# EAGLE design ECG-EEG (EAGLE 7.2.0)
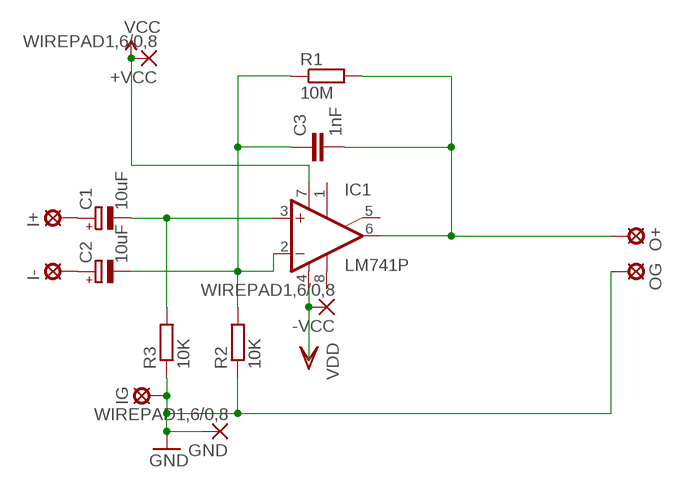
[diagram p0: schematic, sheet 1]

## Parts
+VCC  WIREPAD1,6/0,8  [1,6/0,8]
-VCC  WIREPAD1,6/0,8  [1,6/0,8]
C1  10uF  CPOL-EUE1.8-4  [E1,8-4]
C2  10uF  CPOL-EUE1.8-4  [E1,8-4]
C3  1nF  C-EU025-025X050  [C025-025X050]
GND  WIREPAD1,6/0,8  [1,6/0,8]
I+  LSP10  [LSP10]
I-  LSP10  [LSP10]
IC1  LM741P  [DIL08]
IG  LSP10  [LSP10]
O+  LSP10  [LSP10]
OG  LSP10  [LSP10]
R1  10M  R-EU_0204/7  [0204/7]
R2  10K  R-EU_0204/7  [0204/7]
R3  10K  R-EU_0204/7  [0204/7]

## Nets
+VCC: +VCC.1(P) IC1.7(V+) ; supply symbol labelled VCC
GND: GND.1(P) IG.MP OG.MP R2.1 R3.1
N$1: C1.- IC1.3(+IN) R3.2
N$2: C2.- C3.1 IC1.2(-IN) R1.1 R2.2
N$3: -VCC.1(P) IC1.4(V-)
N$4: C3.2 IC1.6(OUT) O+.MP R1.2
N$6: C1.+ I+.MP
N$7: C2.+ I-.MP
Unconnected: IC1.1(ON1) IC1.5(ON2) IC1.8(OPT)

## Library data of the parts
+VCC -VCC GND = wirepad:WIREPAD: Wire PAD connect wire on PCB
C1 C2 = resistor:CPOL-EU: POLARIZED CAPACITOR, European symbol
C3 = resistor:C-EU: CAPACITOR, European symbol
I+ I- IG O+ OG = solpad:LSP10: SOLDER PAD drill 1.0 mm, distributor Buerklin, 12H555
IC1 = linear:*741: OP AMP
R1-R3 = rcl:R-EU_: RESISTOR, European symbol

## Board
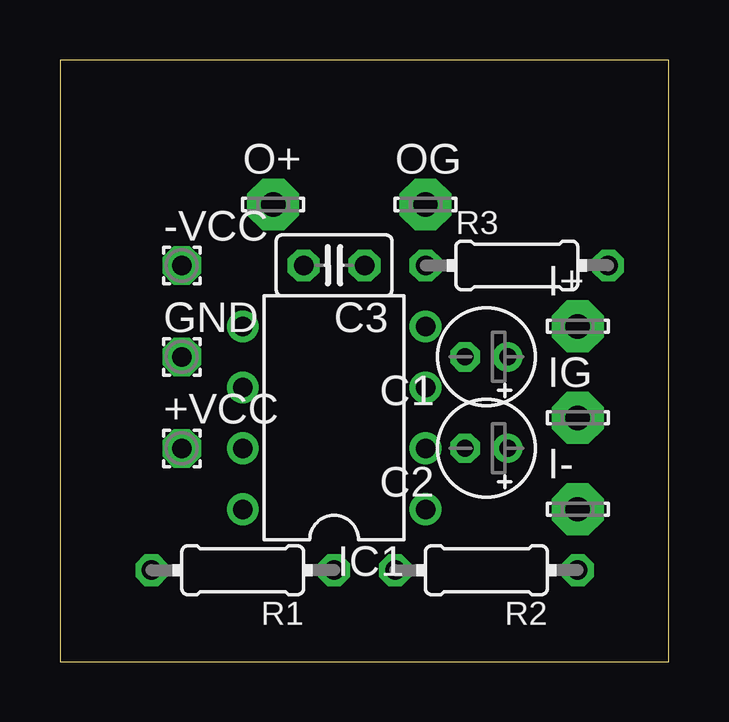
[diagram p1: board, top side]
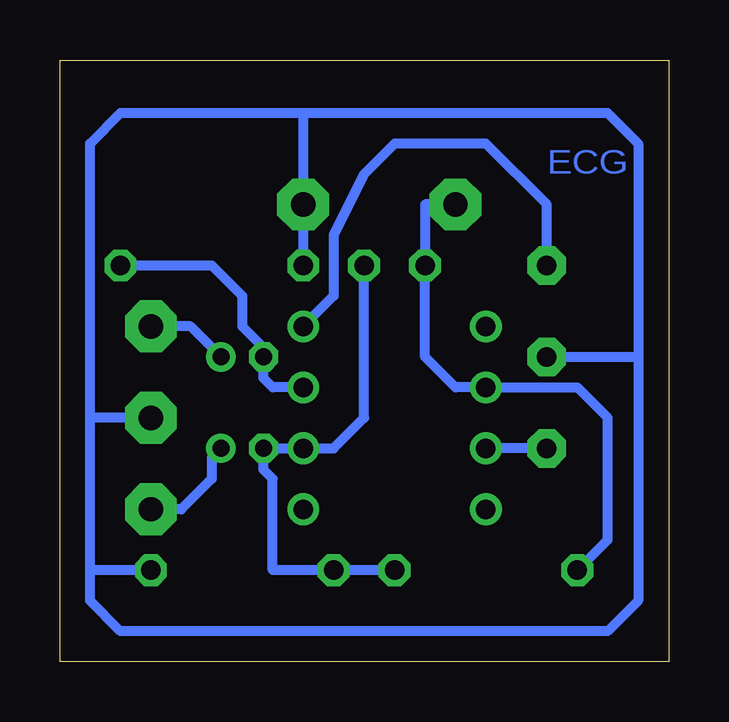
[diagram p2: board, bottom side, seen from below]

Size 25.38 x 25.07 mm. Coordinates in mm from the lower left corner, seen from the top.
Outline: 0,0 25.38,0 25.38,25.07 0,25.07 0,0
Copper layers (1*16): Top 0.035mm / dielectric 1.5mm / Bottom 0.035mm
Design rules "default": minimum track width 10mil, minimum drill 24mil, track to track 8mil, track to pad 8mil, pad to pad 8mil, via to via 8mil, smd to smd 8mil, copper to edge 40mil, drill to drill 8mil, minimum pad ring 10mil, minimum via ring 8mil, stop-mask expansion 4mil, vias tented up to drill 0mil, thermal gap 10mil

### Footprints (pad centres in the part's own frame; a part is rotated, then mirrored left to right if it is on the bottom)
1,6/0,8 = drill 0.813 pad 1.6 octagon: 1 0,0
E1,8-4 = drill 0.711 pad 1.168: + -0.889,0 | drill 0.711 pad 1.168 octagon: - 0.889,0
C025-025X050 = drill 0.813 octagon: 1 -1.27,0; 2 1.27,0
LSP10 = drill 1.016 pad 2.159 octagon: MP 0,0
DIL08 = drill 0.813 pad 1.27: 1 -3.81,-3.81; 2 -1.27,-3.81; 3 1.27,-3.81; 4 3.81,-3.81; 5 3.81,3.81; 6 1.27,3.81; 7 -1.27,3.81; 8 -3.81,3.81
0204/7 = drill 0.813 octagon: 1 -3.81,0; 2 3.81,0

### Placement (x,y rotation side)
+VCC  5.08,8.89 0 top
-VCC  5.08,16.51 0 top
C1  17.78,12.7 180 top
C2  17.78,8.89 180 top
C3  11.43,16.51 180 top
GND  5.08,12.7 0 top
I+  21.59,13.97 0 top
I-  21.59,6.35 0 top
IC1  11.43,10.16 90 top
IG  21.59,10.16 0 top
O+  8.89,19.05 0 top
OG  15.24,19.05 0 top
R1  7.62,3.81 180 top
R2  17.78,3.81 180 top
R3  19.05,16.51 0 top

### Tracks (layer width: path | path; a pad name or v marks a point on that pad's centre or on a via)
+VCC
  Bottom 0.406: +VCC.1 IC1.7
GND
  Bottom 0.406: R3.1 OG.MP 15.24,22.86 | 24.13,3.81 24.13,2.54 22.86,1.27 2.54,1.27 1.27,2.54 1.27,12.7 | 24.13,3.81 24.13,10.16 | IG.MP 24.13,10.16 | 24.13,10.16 24.13,21.59 22.86,22.86 15.24,22.86 | GND.1 1.27,12.7 | 15.24,22.86 2.54,22.86 1.27,21.59 1.27,12.7 | R2.1 24.13,3.81
N$1
  Bottom 0.406: R3.2 19.05,16.51 17.78,15.24 17.78,13.97 16.89,13.08 C1.- 16.89,11.81 16.51,11.43 IC1.3
N$2
  Bottom 0.406: R1.1 R2.2 16.51,3.81 16.51,7.62 16.89,8 C2.- IC1.2 13.97,8.89 12.7,10.16 C3.1
N$3
  Bottom 0.406: -VCC.1 5.08,19.05 7.62,21.59 11.43,21.59 12.7,20.32 13.97,17.78 13.97,15.24 IC1.4
N$4
  Bottom 0.406: O+.MP 10.16,19.05 C3.2 10.16,12.7 8.89,11.43 IC1.6 3.81,11.43 2.54,10.16 2.54,5.08 R1.2
N$6
  Bottom 0.406: C1.+ 19.94,13.97 I+.MP
N$7
  Bottom 0.406: C2.+ 19.05,8.51 19.05,7.62 20.32,6.35 I-.MP

### Text on the board
Bottom: ECG